# Altium project SuperGameBro_RevA0.PrjPcb
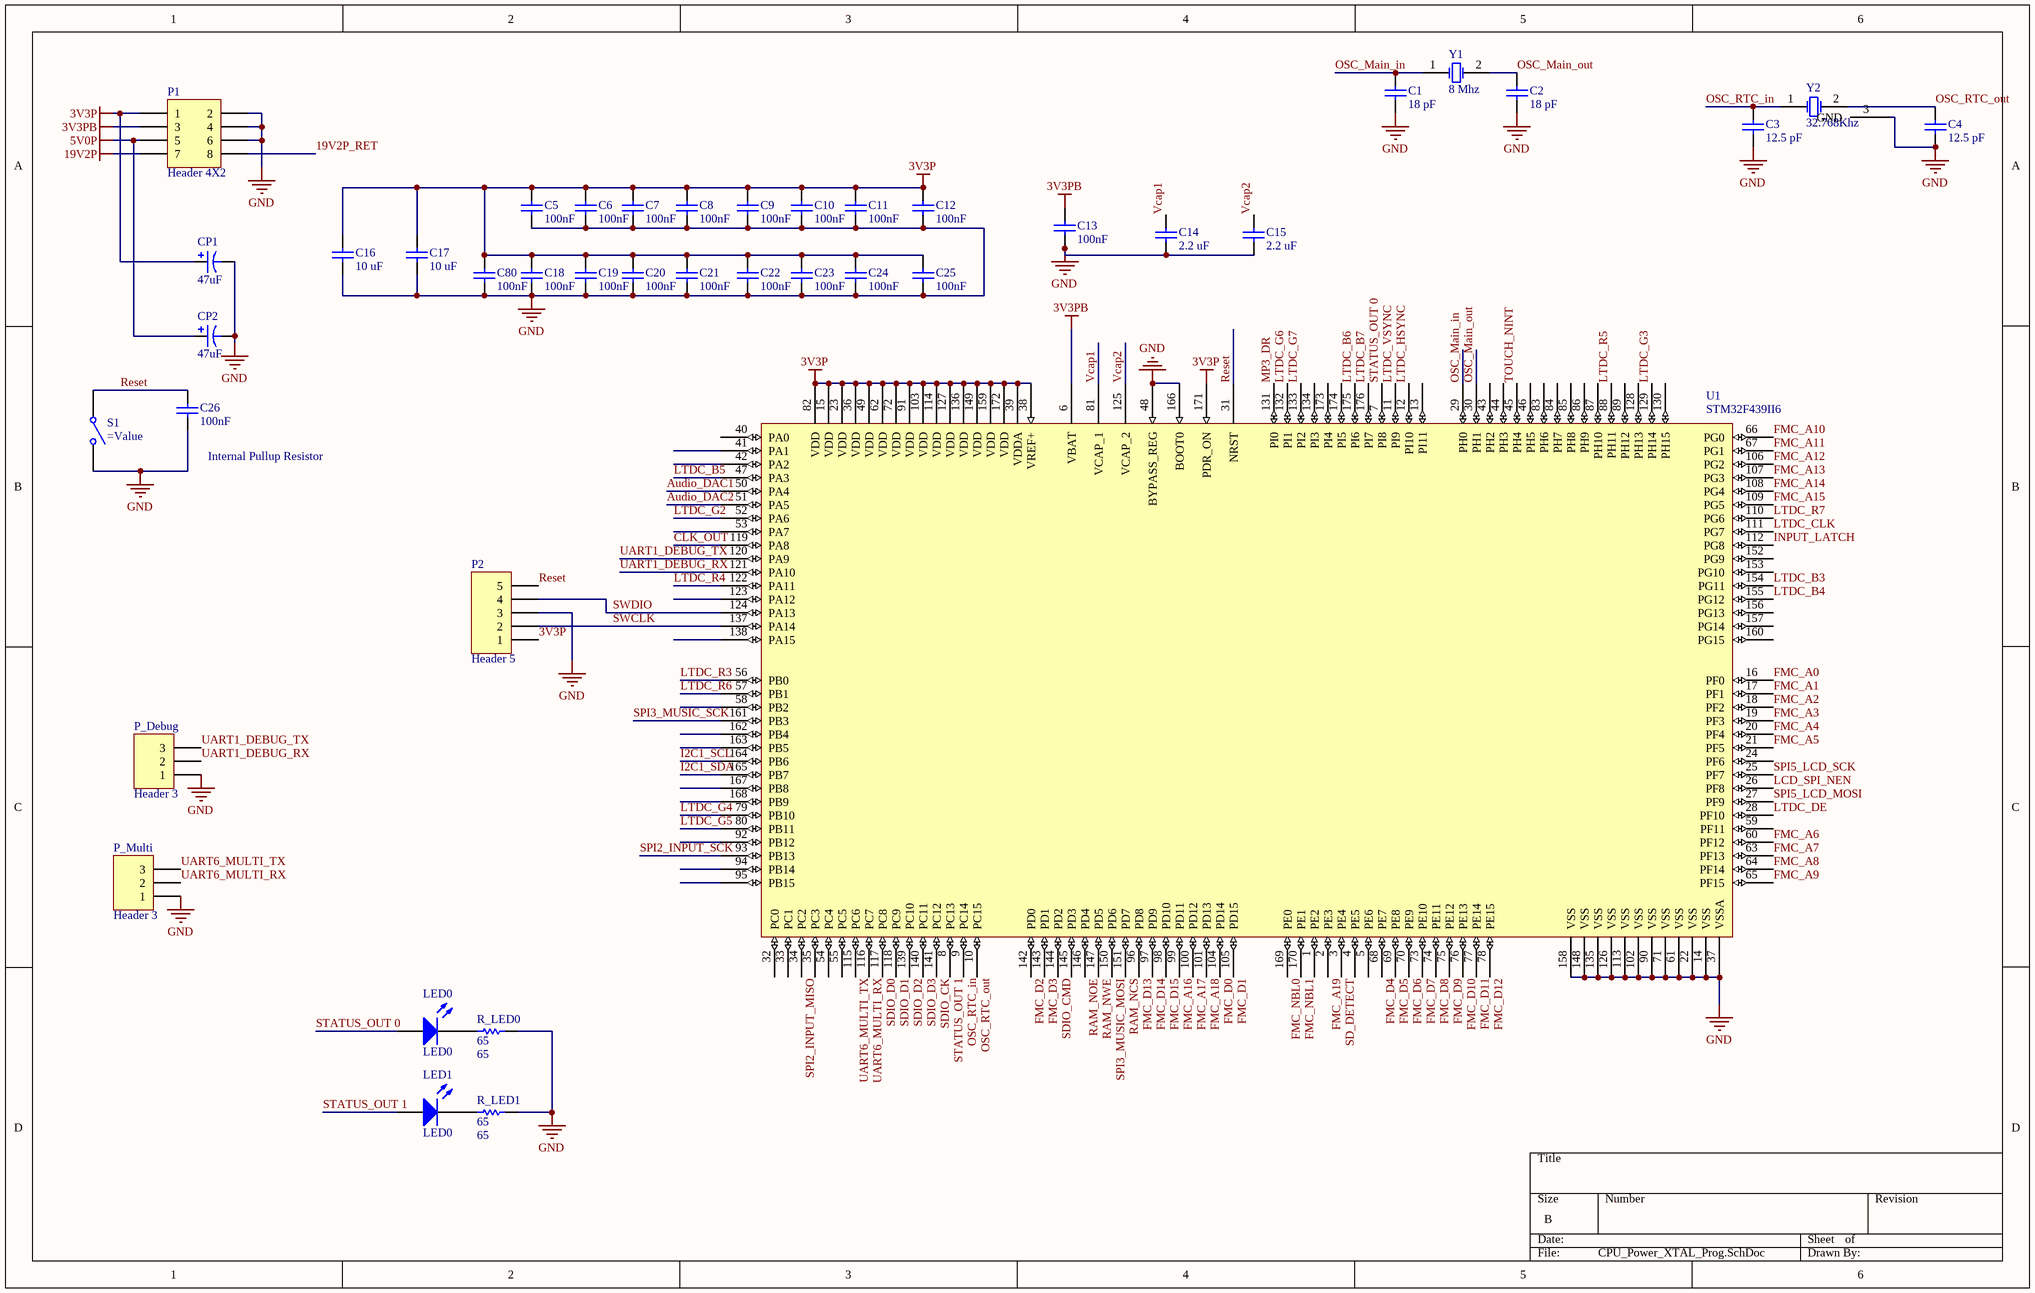
[diagram p0: CPU_Power_XTAL_Prog.SchDoc]
5 sheets, 150 parts. Net scope: global (net labels, ports and power ports of the same name join across sheets).
Board files: SuperGameBro_RevA0.PcbDoc, SuperGameBro_RevA1.PcbDoc
Sheets:
  CPU_Power_XTAL_Prog.SchDoc
  sdcard_ram.SchDoc
  Buttons.SchDoc
  LCD_touch_conn.SchDoc
  Audio.SchDoc

## Sheet CPU_Power_XTAL_Prog.SchDoc
size B

### Parts
C1  18 pF  [C0805]
C2  18 pF  [C0805]
C3  12.5 pF  [C0805]
C4  12.5 pF  [C0805]
C5  100nF  [C0805]
C6  100nF  [C0805]
C7  100nF  [C0805]
C8  100nF  [C0805]
C9  100nF  [C0805]
C10  100nF  [C0805]
C11  100nF  [C0805]
C12  100nF  [C0805]
C13  100nF  [C0805]
C14  2.2 uF  [C0805]
C15  2.2 uF  [C0805]
C16  10 uF  [C0805]
C17  10 uF  [C0805]
C18  100nF  [C0805]
C19  100nF  [C0805]
C20  100nF  [C0805]
C21  100nF  [C0805]
C22  100nF  [C0805]
C23  100nF  [C0805]
C24  100nF  [C0805]
C25  100nF  [C0805]
C26  100nF  [C0805]
C80  100nF  [C0805]
CP1  47uF  [KemetC3]
CP2  47uF  [KemetC3]
LED0  LED0  [LED-LTST]
LED1  LED0  [LED-LTST]
P1  Header 4X2  [Molex MiniFit Jr8]
P2  Header 5  [HDR1X5]
P_Debug  Header 3  [HDR1X3]
P_Multi  Header 3  [HDR1X3]
R_LED0  65  [6-0805_M]
R_LED1  65  [6-0805_M]
S1  (no value)  [Reset_Button]
U1  STM32F439II6  [LQFP76]
Y1  8 Mhz  [HC-49U]
Y2  32.768Khz  [C-2Type Crystal]

### Nets
3V3P: C5.2 C6.2 C7.2 C8.2 C9.2 C10.2 C11.2 C12.2 C16.2 C17.2 C18.2 C19.2 C20.2 C21.2 C22.2 C23.2 C24.2 C25.2 C80.2 CP1.2 P1.1 P2.1 U1.15(VDD) U1.23(VDD) U1.36(VDD) U1.38(VREF+) U1.39(VDDA) U1.49(VDD) U1.62(VDD) U1.72(VDD) U1.82(VDD) U1.91(VDD) U1.103(VDD) U1.114(VDD) U1.127(VDD) U1.136(VDD) U1.149(VDD) U1.159(VDD) U1.171(PDR_ON) U1.172(VDD)
3V3PB: C13.1 P1.3 U1.6(VBAT)
5V0P: CP2.2 P1.5
19V2P: P1.7
GND: C1.1 C2.1 C3.1 C4.1 C5.1 C6.1 C7.1 C8.1 C9.1 C10.1 C11.1 C12.1 C13.2 C14.2 C15.2 C16.1 C17.1 C18.1 C19.1 C20.1 C21.1 C22.1 C23.1 C24.1 C25.1 C26.1 C80.1 CP1.1 CP2.1 P1.2 P1.4 P1.6 P2.3 P_Debug.1 P_Multi.1 R_LED0.2 R_LED1.2 S1.1(NO) U1.14(VSS) U1.22(VSS) U1.37(VSSA) U1.48(BYPASS_REG) U1.61(VSS) U1.71(VSS) U1.90(VSS) U1.102(VSS) U1.113(VSS) U1.126(VSS) U1.135(VSS) U1.148(VSS) U1.158(VSS) U1.166(BOOT0) Y2.3(GND)
19V2P_RET: P1.8
Audio_DAC1: U1.50(PA4)
Audio_DAC2: U1.51(PA5)
CLK_OUT: U1.119(PA8)
FMC_A0: U1.16(PF0)
FMC_A1: U1.17(PF1)
FMC_A2: U1.18(PF2)
FMC_A3: U1.19(PF3)
FMC_A4: U1.20(PF4)
FMC_A5: U1.21(PF5)
FMC_A6: U1.60(PF12)
FMC_A7: U1.63(PF13)
FMC_A8: U1.64(PF14)
FMC_A9: U1.65(PF15)
FMC_A10: U1.66(PG0)
FMC_A11: U1.67(PG1)
FMC_A12: U1.106(PG2)
FMC_A13: U1.107(PG3)
FMC_A14: U1.108(PG4)
FMC_A15: U1.109(PG5)
FMC_A16: U1.99(PD11)
FMC_A17: U1.100(PD12)
FMC_A18: U1.101(PD13)
FMC_A19: U1.2(PE3)
FMC_D0: U1.104(PD14)
FMC_D1: U1.105(PD15)
FMC_D2: U1.142(PD0)
FMC_D3: U1.143(PD1)
FMC_D4: U1.68(PE7)
FMC_D5: U1.69(PE8)
FMC_D6: U1.70(PE9)
FMC_D7: U1.73(PE10)
FMC_D8: U1.74(PE11)
FMC_D9: U1.75(PE12)
FMC_D10: U1.76(PE13)
FMC_D11: U1.77(PE14)
FMC_D12: U1.78(PE15)
FMC_D13: U1.96(PD8)
FMC_D14: U1.97(PD9)
FMC_D15: U1.98(PD10)
FMC_NBL0: U1.169(PE0)
FMC_NBL1: U1.170(PE1)
I2C1_SCL: U1.164(PB6)
I2C1_SDA: U1.165(PB7)
INPUT_LATCH: U1.112(PG8)
LCD_SPI_NEN: U1.26(PF8)
LTDC_B3: U1.154(PG11)
LTDC_B4: U1.155(PG12)
LTDC_B5: U1.47(PA3)
LTDC_B6: U1.175(PI6)
LTDC_B7: U1.176(PI7)
LTDC_CLK: U1.111(PG7)
LTDC_DE: U1.28(PF10)
LTDC_G2: U1.52(PA6)
LTDC_G3: U1.129(PH14)
LTDC_G4: U1.79(PB10)
LTDC_G5: U1.80(PB11)
LTDC_G6: U1.132(PI1)
LTDC_G7: U1.133(PI2)
LTDC_HSYNC: U1.12(PI10)
LTDC_R3: U1.56(PB0)
LTDC_R4: U1.122(PA11)
LTDC_R5: U1.88(PH11)
LTDC_R6: U1.57(PB1)
LTDC_R7: U1.110(PG6)
LTDC_VSYNC: U1.11(PI9)
MP3_DR: U1.131(PI0)
OSC_Main_in: C1.2 U1.29(PH0) Y1.1(OSC1)
OSC_Main_out: C2.2 U1.30(PH1) Y1.2(OSC2)
OSC_RTC_in: C3.2 U1.9(PC14) Y2.1(OSC1)
OSC_RTC_out: C4.2 U1.10(PC15) Y2.2(OSC2)
RAM_NCS: U1.151(PD7)
RAM_NOE: U1.146(PD4)
RAM_NWE: U1.147(PD5)
Reset: C26.2 P2.5 S1.0(COMMON) U1.31(NRST)
SD_DETECT: U1.3(PE4)
SDIO_CK: U1.141(PC12)
SDIO_CMD: U1.144(PD2)
SDIO_D0: U1.117(PC8)
SDIO_D1: U1.118(PC9)
SDIO_D2: U1.139(PC10)
SDIO_D3: U1.140(PC11)
SPI2_INPUT_MISO: U1.34(PC2)
SPI2_INPUT_SCK: U1.93(PB13)
SPI3_MUSIC_MOSI: U1.150(PD6)
SPI3_MUSIC_SCK: U1.161(PB3)
SPI5_LCD_MOSI: U1.27(PF9)
SPI5_LCD_SCK: U1.25(PF7)
STATUS_OUT 0: LED0.A U1.7(PI8)
STATUS_OUT 1: LED1.A U1.8(PC13)
SWCLK: P2.2 U1.137(PA14)
SWDIO: P2.4 U1.124(PA13)
TOUCH_NINT: U1.45(PH4)
UART1_DEBUG_RX: P_Debug.2 U1.121(PA10)
UART1_DEBUG_TX: P_Debug.3 U1.120(PA9)
UART6_MULTI_RX: P_Multi.2 U1.116(PC7)
UART6_MULTI_TX: P_Multi.3 U1.115(PC6)
Vcap1: C14.1 U1.81(VCAP_1)
Vcap2: C15.1 U1.125(VCAP_2)
NetLED0_K: LED0.K R_LED0.1
NetLED1_K: LED1.K R_LED1.1

Not connected (* = marked no-connect by the designer): U1 1(PE2) 4(PE5) 5(PE6) 13(PI11) 24(PF6) 32(PC0) 33(PC1) 35(PC3) 40(PA0) 41(PA1) 42(PA2) 43(PH2) 44(PH3) 46(PH5) 53(PA7) 54(PC4) 55(PC5) 58(PB2) 59(PF11) 83(PH6) 84(PH7) 85(PH8) 86(PH9) 87(PH10) 89(PH12) 92(PB12) 94(PB14) 95(PB15) 123(PA12) 128(PH13) 130(PH15) 134(PI3) 138(PA15) 145(PD3) 152(PG9) 153(PG10) 156(PG13) 157(PG14) 160(PG15) 162(PB4) 163(PB5) 167(PB8) 168(PB9) 173(PI4) 174(PI5)

### Notes on the sheet
- (near C26) Internal Pullup Resistor

### Library data of the parts
C1-C26 C80 = Cap: Capacitor; Published: 8-Jun-2000; LatestRevisionDate: 17-Jul-2002; LatestRevisionNote: Re-released for DXP Platform.; PackageReference: RAD-0.3; Publisher: Altium Limited; PackageDescription: Radial Cap, Thru-Hole; 2 Leads; 0.3 in Pin Spacing
  C1 C2: Value: 18 pF
  C3 C4: Value: 12.5 pF
  C5-C13 C18-C26 C80: Value: 100nF
  C14 C15: Value: 2.2 uF
  C16 C17: Value: 10 uF
CP1 CP2 = Cap Pol1: Polarized Capacitor (Radial); Published: 8-Jun-2000; LatestRevisionDate: 17-Jul-2002; LatestRevisionNote: Re-released for DXP Platform.; PackageReference: RB7.6-15; Publisher: Altium Limited; PackageDescription: Polarized Capacitor (Radial); 2 Leads; Value: 47uF
LED0 LED1 = LED0: Typical INFRARED GaAs LED; Published: 8-Jun-2000; LatestRevisionDate: 08-Jul-2005; LatestRevisionNote: Mech Layer 1 removed.; PackageReference: LED-0; Publisher: Altium Limited; PackageDescription: LED; 2 Leads
P1 = Header 4X2: Header, 4-Pin, Dual row; LatestRevisionDate: 17-Jul-2002; LatestRevisionNote: Re-released for DXP Platform.; Publisher: Altium Limited
P2 = Header 5: Header, 5-Pin; LatestRevisionDate: 17-Jul-2002; LatestRevisionNote: Re-released for DXP Platform.; Publisher: Altium Limited
P_Debug P_Multi = Header 3: Header, 3-Pin; LatestRevisionDate: 17-Jul-2002; LatestRevisionNote: Re-released for DXP Platform.; Publisher: Altium Limited
R_LED0 R_LED1 = Res1: Resistor; Published: 8-Jun-2000; LatestRevisionDate: 17-Jul-2002; LatestRevisionNote: Re-released for DXP Platform.; PackageReference: AXIAL-0.3; Publisher: Altium Limited; PackageDescription: Axial Device, Thru-Hole; 2 Leads; 0.3 in Pin Spacing; Value: 65
S1 = SW-SPST: Single-Pole, Single-Throw Switch; Published: 24-Mar-1999; LatestRevisionDate: 17-Jul-2002; LatestRevisionNote: Re-released for DXP Platform.; PackageReference: SPST-2; Publisher: Altium Limited; PackageDescription: Switch; 2 Leads
U1 = STM32F439IIT6: Arm Cortex M4 Processor
Y1 Y2 = XTAL: Crystal Oscillator; Published: 8-Jun-2000; LatestRevisionDate: 17-Jul-2002; LatestRevisionNote: Re-released for DXP Platform.; PackageReference: R38; Publisher: Altium Limited; PackageDescription: Crystal, Thru-Hole; 2 Leads; Body 3.1 x 8.2 mm (Dia.xH)

## Sheet sdcard_ram.SchDoc
size Letter
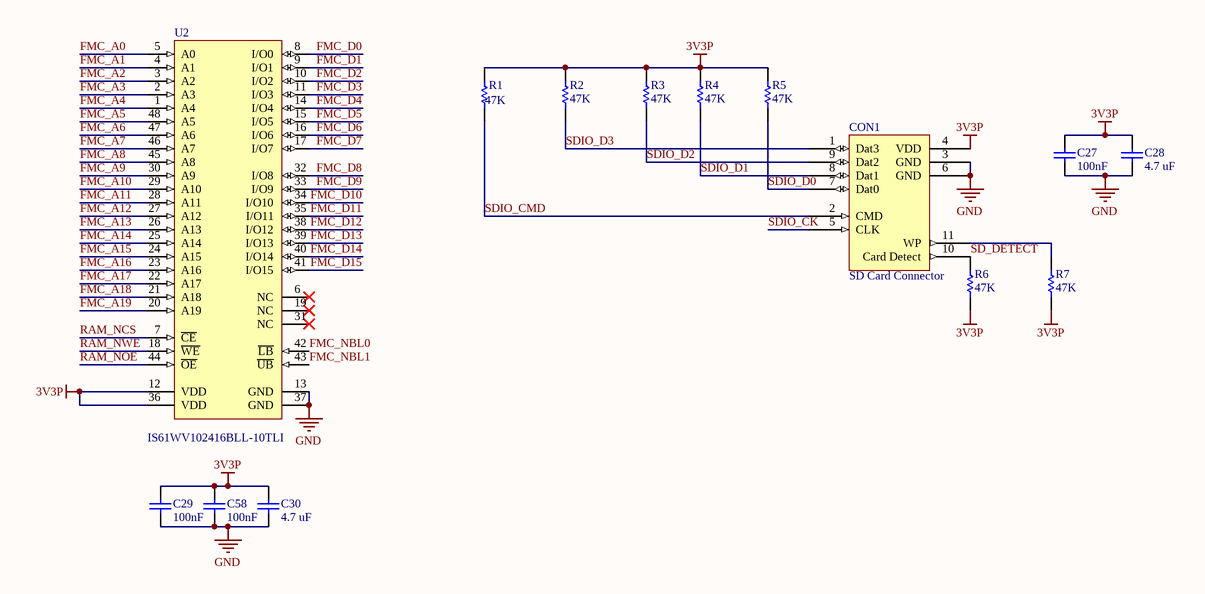
[diagram p1: sdcard_ram.SchDoc]

### Parts
C27  100nF  [C0805]
C28  4.7 uF  [C0805]
C29  100nF  [C0805]
C30  4.7 uF  [C0805]
C58  100nF  [C0805]
CON1  SD Card Connector  [SD_card_fp]
R1  47K  [6-0805_M]
R2  47K  [6-0805_M]
R3  47K  [6-0805_M]
R4  47K  [6-0805_M]
R5  47K  [6-0805_M]
R6  47K  [6-0805_M]
R7  47K  [6-0805_M]
U2  IS61WV102416BLL-10TLI  [ISSI-TSOP-1-48-12000X20000DE_N]

### Nets
3V3P: C27.2 C28.2 C29.2 C30.2 C58.2 CON1.4(VDD) R1.2 R2.2 R3.2 R4.2 R5.2 R6.1 R7.1 U2.12(VDD) U2.36(VDD)
GND: C27.1 C28.1 C29.1 C30.1 C58.1 CON1.3(GND) CON1.6(GND) U2.13(GND) U2.37(GND)
FMC_A0: U2.5(A0)
FMC_A1: U2.4(A1)
FMC_A2: U2.3(A2)
FMC_A3: U2.2(A3)
FMC_A4: U2.1(A4)
FMC_A5: U2.48(A5)
FMC_A6: U2.47(A6)
FMC_A7: U2.46(A7)
FMC_A8: U2.45(A8)
FMC_A9: U2.30(A9)
FMC_A10: U2.29(A10)
FMC_A11: U2.28(A11)
FMC_A12: U2.27(A12)
FMC_A13: U2.26(A13)
FMC_A14: U2.25(A14)
FMC_A15: U2.24(A15)
FMC_A16: U2.23(A16)
FMC_A17: U2.22(A17)
FMC_A18: U2.21(A18)
FMC_A19: U2.20(A19)
FMC_D0: U2.8(I/O0)
FMC_D1: U2.9(I/O1)
FMC_D2: U2.10(I/O2)
FMC_D3: U2.11(I/O3)
FMC_D4: U2.14(I/O4)
FMC_D5: U2.15(I/O5)
FMC_D6: U2.16(I/O6)
FMC_D7: U2.17(I/O7)
FMC_D8: U2.32(I/O8)
FMC_D9: U2.33(I/O9)
FMC_D10: U2.34(I/O10)
FMC_D11: U2.35(I/O11)
FMC_D12: U2.38(I/O12)
FMC_D13: U2.39(I/O13)
FMC_D14: U2.40(I/O14)
FMC_D15: U2.41(I/O15)
FMC_NBL0: U2.42(~{LB})
FMC_NBL1: U2.43(~{UB})
RAM_NCS: U2.7(~{CE})
RAM_NOE: U2.44(~{OE})
RAM_NWE: U2.18(~{WE})
SD_DETECT: CON1.10(Card_Detect) R6.2
SDIO_CK: CON1.5(CLK)
SDIO_CMD: CON1.2(CMD) R1.1
SDIO_D0: CON1.7(Dat0) R5.1
SDIO_D1: CON1.8(Dat1) R4.1
SDIO_D2: CON1.9(Dat2) R3.1
SDIO_D3: CON1.1(Dat3) R2.1
NetCON1_11: CON1.11(WP) R7.2

Not connected (* = marked no-connect by the designer): U2 6(NC)* 19(NC)* 31(NC)*

### Library data of the parts
C27-C30 C58 = Cap: Capacitor; Published: 8-Jun-2000; LatestRevisionDate: 17-Jul-2002; LatestRevisionNote: Re-released for DXP Platform.; PackageReference: RAD-0.3; Publisher: Altium Limited; PackageDescription: Radial Cap, Thru-Hole; 2 Leads; 0.3 in Pin Spacing
  C27 C29 C58: Value: 100nF
  C28 C30: Value: 4.7 uF
CON1 = SD Card Connector: 3M™ Card Connector SD™
R1-R7 = Res1: Resistor; Published: 8-Jun-2000; LatestRevisionDate: 17-Jul-2002; LatestRevisionNote: Re-released for DXP Platform.; PackageReference: AXIAL-0.3; Publisher: Altium Limited; PackageDescription: Axial Device, Thru-Hole; 2 Leads; 0.3 in Pin Spacing; Value: 47K
U2 = IS61WV102416BLL-10TLI: 16 M High Speed Asynchronous CMOS SRAM with 3.3 V Supply, 1 M x 16, -40 to 85 degC, 48-Pin SOP (TSOP-1-48), Pb-Free; Manufacturer: Integrated Silicon Solution Inc (ISSI); Density: 16M; Organization: 1M x 16; Packing: Tray / Tube; Speed (ns): 10; DatasheetVersion: Rev. F; PackageVersion: Rev. B, 07/2006; PackageReference: TSOP-1-48; PackageDescription: 48-Pin 12 x 20 mm TSOP-1, Pitch 0.5 mm; Supplier 1: Digi-Key; Supplier Part Number 1: 706-1055-ND; Supplier 2: Farnell; Supplier Part Number 2: 2253839; Supplier 3: Newark; Supplier Part Number 3: 53W9303; Supplier 4: Newark; Supplier Part Number 4: 43M5379; Supplier 5: Mouser; Supplier Part Number 5: 870-61WV102416B10TLI; RoHS: Pb-Free; Mounting Technology: Surface Mount; PartNumber: IS61WV102416BLL-10TLI; ComponentLink1Description: Manufacturer URL; ComponentLink1URL: http://www.issi.com/US/index.shtml; ComponentLink2Description: Datasheet; ComponentLink2URL: http://www.issi.com/WW/pdf/61WV102416ALL.pdf; ComponentLink3Description: Package Specification; ComponentLink3URL: http://www.issi.com/WW/pdf/61WV102416ALL.pdf

## Sheet Buttons.SchDoc
size Letter
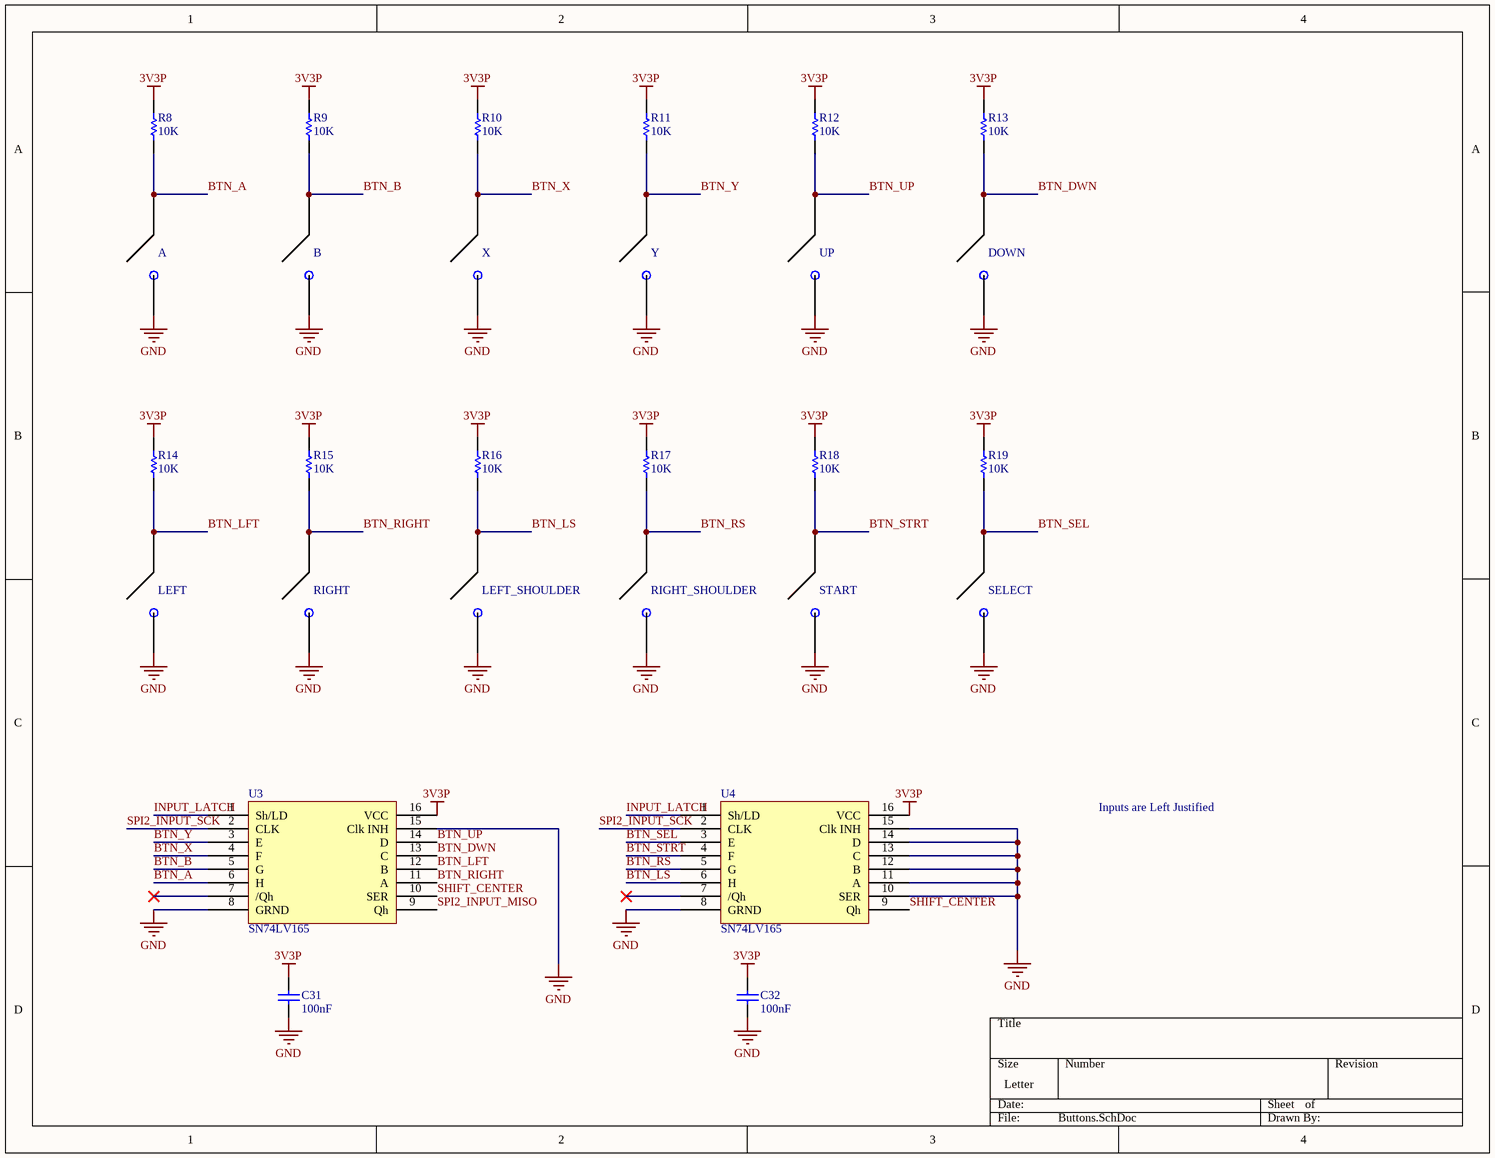
[diagram p2: Buttons.SchDoc]

### Parts
A  12mmBTN  [SMT12mmbutton]  (value not drawn)
B  12mmBTN  [SMT12mmbutton]  (value not drawn)
C31  100nF  [C0805]
C32  100nF  [C0805]
DOWN  12mmBTN  [SMT12mmbutton]  (value not drawn)
LEFT  12mmBTN  [SMT12mmbutton]  (value not drawn)
LEFT_SHOULDER  12mmBTN  [HDR1X2]  (value not drawn)
R8  10K  [6-0805_M]
R9  10K  [6-0805_M]
R10  10K  [6-0805_M]
R11  10K  [6-0805_M]
R12  10K  [6-0805_M]
R13  10K  [6-0805_M]
R14  10K  [6-0805_M]
R15  10K  [6-0805_M]
R16  10K  [6-0805_M]
R17  10K  [6-0805_M]
R18  10K  [6-0805_M]
R19  10K  [6-0805_M]
RIGHT  12mmBTN  [SMT12mmbutton]  (value not drawn)
RIGHT_SHOULDER  12mmBTN  [HDR1X2]  (value not drawn)
SELECT  12mmBTN  [SMT12mmbutton]  (value not drawn)
START  12mmBTN  [SMT12mmbutton]  (value not drawn)
U3  SN74LV165  [SOP16_Hand]
U4  SN74LV165  [SOP16_Hand]
UP  12mmBTN  [SMT12mmbutton]  (value not drawn)
X  12mmBTN  [SMT12mmbutton]  (value not drawn)
Y  12mmBTN  [SMT12mmbutton]  (value not drawn)

### Nets
3V3P: C31.2 C32.2 R8.1 R9.1 R10.1 R11.1 R12.1 R13.1 R14.1 R15.1 R16.1 R17.1 R18.1 R19.1 U3.16(VCC) U4.16(VCC)
GND: A.0 B.0 C31.1 C32.1 DOWN.0 LEFT.0 LEFT_SHOULDER.1 RIGHT.0 RIGHT_SHOULDER.1 SELECT.0 START.0 U3.8(GRND) U3.15(Clk_INH) U4.8(GRND) U4.10(SER) U4.11(A) U4.12(B) U4.13(C) U4.14(D) U4.15(Clk_INH) UP.0 X.0 Y.0
BTN_A: A.1 R8.2 U3.6(H)
BTN_B: B.1 R9.2 U3.5(G)
BTN_DWN: DOWN.1 R13.2 U3.13(C)
BTN_LFT: LEFT.1 R14.2 U3.12(B)
BTN_LS: LEFT_SHOULDER.2 R16.2 U4.6(H)
BTN_RIGHT: R15.2 RIGHT.1 U3.11(A)
BTN_RS: R17.2 RIGHT_SHOULDER.2 U4.5(G)
BTN_SEL: R19.2 SELECT.1 U4.3(E)
BTN_STRT: R18.2 START.1 U4.4(F)
BTN_UP: R12.2 U3.14(D) UP.1
BTN_X: R10.2 U3.4(F) X.1
BTN_Y: R11.2 U3.3(E) Y.1
INPUT_LATCH: U3.1(Sh/LD) U4.1(Sh/LD)
SHIFT_CENTER: U3.10(SER) U4.9(Qh)
SPI2_INPUT_MISO: U3.9(Qh)
SPI2_INPUT_SCK: U3.2(CLK) U4.2(CLK)

Not connected (* = marked no-connect by the designer): U3 7(/Qh)*; U4 7(/Qh)*

### Notes on the sheet
- Inputs are Left Justified

### Library data of the parts
C31 C32 = Cap: Capacitor; Published: 8-Jun-2000; LatestRevisionDate: 17-Jul-2002; LatestRevisionNote: Re-released for DXP Platform.; PackageReference: RAD-0.3; Publisher: Altium Limited; PackageDescription: Radial Cap, Thru-Hole; 2 Leads; 0.3 in Pin Spacing; Value: 100nF
R8-R19 = Res1: Resistor; Published: 8-Jun-2000; LatestRevisionDate: 17-Jul-2002; LatestRevisionNote: Re-released for DXP Platform.; PackageReference: AXIAL-0.3; Publisher: Altium Limited; PackageDescription: Axial Device, Thru-Hole; 2 Leads; 0.3 in Pin Spacing; Value: 10K

## Sheet LCD_touch_conn.SchDoc
size Letter
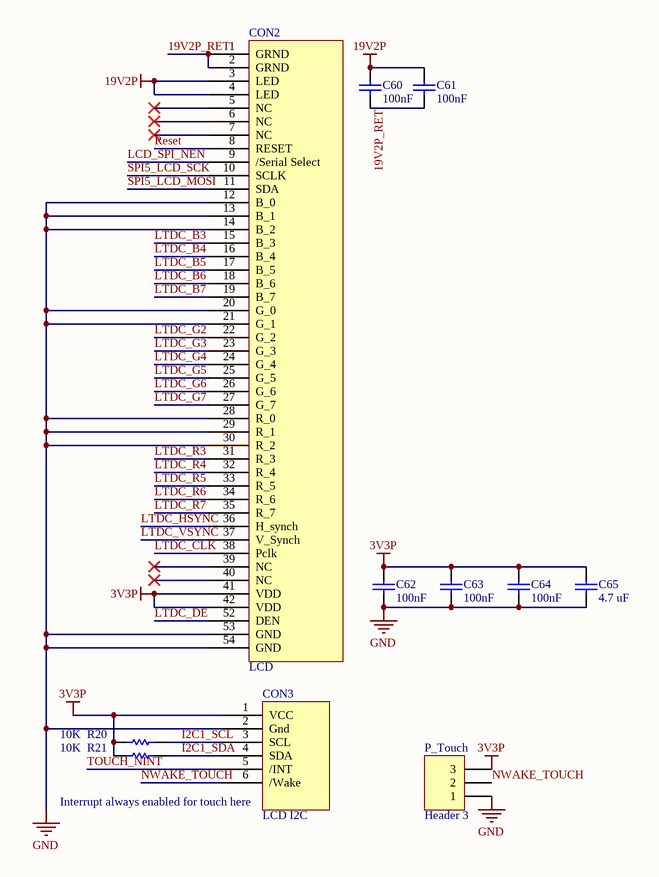
[diagram p3: LCD_touch_conn.SchDoc]

### Parts
C60  100nF  [C0805]
C61  100nF  [C0805]
C62  100nF  [C0805]
C63  100nF  [C0805]
C64  100nF  [C0805]
C65  4.7 uF  [C0805]
CON2  LCD  [Molex54 - duplicate2]
CON3  LCD I2C  [Molex6]
P_Touch  Header 3  [HDR1X3]
R20  10K  [6-0805_M]
R21  10K  [6-0805_M]

### Nets
3V3P: C62.2 C63.2 C64.2 C65.2 CON2.41(VDD) CON2.42(VDD) CON3.1(VCC) P_Touch.3 R20.1 R21.1
19V2P: C60.2 C61.2 CON2.3(LED) CON2.4(LED)
GND: C62.1 C63.1 C64.1 C65.1 CON2.12(B_0) CON2.13(B_1) CON2.14(B_2) CON2.20(G_0) CON2.21(G_1) CON2.28(R_0) CON2.29(R_1) CON2.30(R_2) CON2.53(GND) CON2.54(GND) CON3.2(Gnd) P_Touch.1
19V2P_RET: C60.1 C61.1 CON2.1(GRND) CON2.2(GRND)
I2C1_SCL: CON3.3(SCL) R20.2
I2C1_SDA: CON3.4(SDA) R21.2
LCD_SPI_NEN: CON2.9(/Serial_Select)
LTDC_B3: CON2.15(B_3)
LTDC_B4: CON2.16(B_4)
LTDC_B5: CON2.17(B_5)
LTDC_B6: CON2.18(B_6)
LTDC_B7: CON2.19(B_7)
LTDC_CLK: CON2.38(Pclk)
LTDC_DE: CON2.52(DEN)
LTDC_G2: CON2.22(G_2)
LTDC_G3: CON2.23(G_3)
LTDC_G4: CON2.24(G_4)
LTDC_G5: CON2.25(G_5)
LTDC_G6: CON2.26(G_6)
LTDC_G7: CON2.27(G_7)
LTDC_HSYNC: CON2.36(H_synch)
LTDC_R3: CON2.31(R_3)
LTDC_R4: CON2.32(R_4)
LTDC_R5: CON2.33(R_5)
LTDC_R6: CON2.34(R_6)
LTDC_R7: CON2.35(R_7)
LTDC_VSYNC: CON2.37(V_Synch)
NWAKE_TOUCH: CON3.6(/Wake) P_Touch.2
Reset: CON2.8(RESET)
SPI5_LCD_MOSI: CON2.11(SDA)
SPI5_LCD_SCK: CON2.10(SCLK)
TOUCH_NINT: CON3.5(/INT)

Not connected (* = marked no-connect by the designer): CON2 5(NC)* 6(NC)* 7(NC)* 39(NC)* 40(NC)*

### Notes on the sheet
- (near CON3) Interrupt always enabled for touch here

### Library data of the parts
C60-C65 = Cap: Capacitor; Published: 8-Jun-2000; LatestRevisionDate: 17-Jul-2002; LatestRevisionNote: Re-released for DXP Platform.; PackageReference: RAD-0.3; Publisher: Altium Limited; PackageDescription: Radial Cap, Thru-Hole; 2 Leads; 0.3 in Pin Spacing
  C60-C64: Value: 100nF
  C65: Value: 4.7 uF
CON2 = LCD: pin to pad: 1>A1 2>A2 3>A3 4>A4 5>A5 6>A6 7>A7 8>A8 9>A9 10>A10 11>A11 12>A12 13>A13 14>A14 15>A15 16>A16 17>A17 18>A18 19>A19 20>A20 21>A21 22>A22 23>A23 24>A24 25>A25 26>A26 27>A27 28>A28 29>A29 30>A30 31>A31 32>A32 33>A33 34>A34 35>A35 36>A36 37>A37 38>A38 39>A39 40>A40 41>A41 42>A42 52>A52 53>A53 54>A54
P_Touch = Header 3: Header, 3-Pin; LatestRevisionDate: 17-Jul-2002; LatestRevisionNote: Re-released for DXP Platform.; Publisher: Altium Limited
R20 R21 = Res1: Resistor; Published: 8-Jun-2000; LatestRevisionDate: 17-Jul-2002; LatestRevisionNote: Re-released for DXP Platform.; PackageReference: AXIAL-0.3; Publisher: Altium Limited; PackageDescription: Axial Device, Thru-Hole; 2 Leads; 0.3 in Pin Spacing; Value: 10K

## Sheet Audio.SchDoc
size Letter
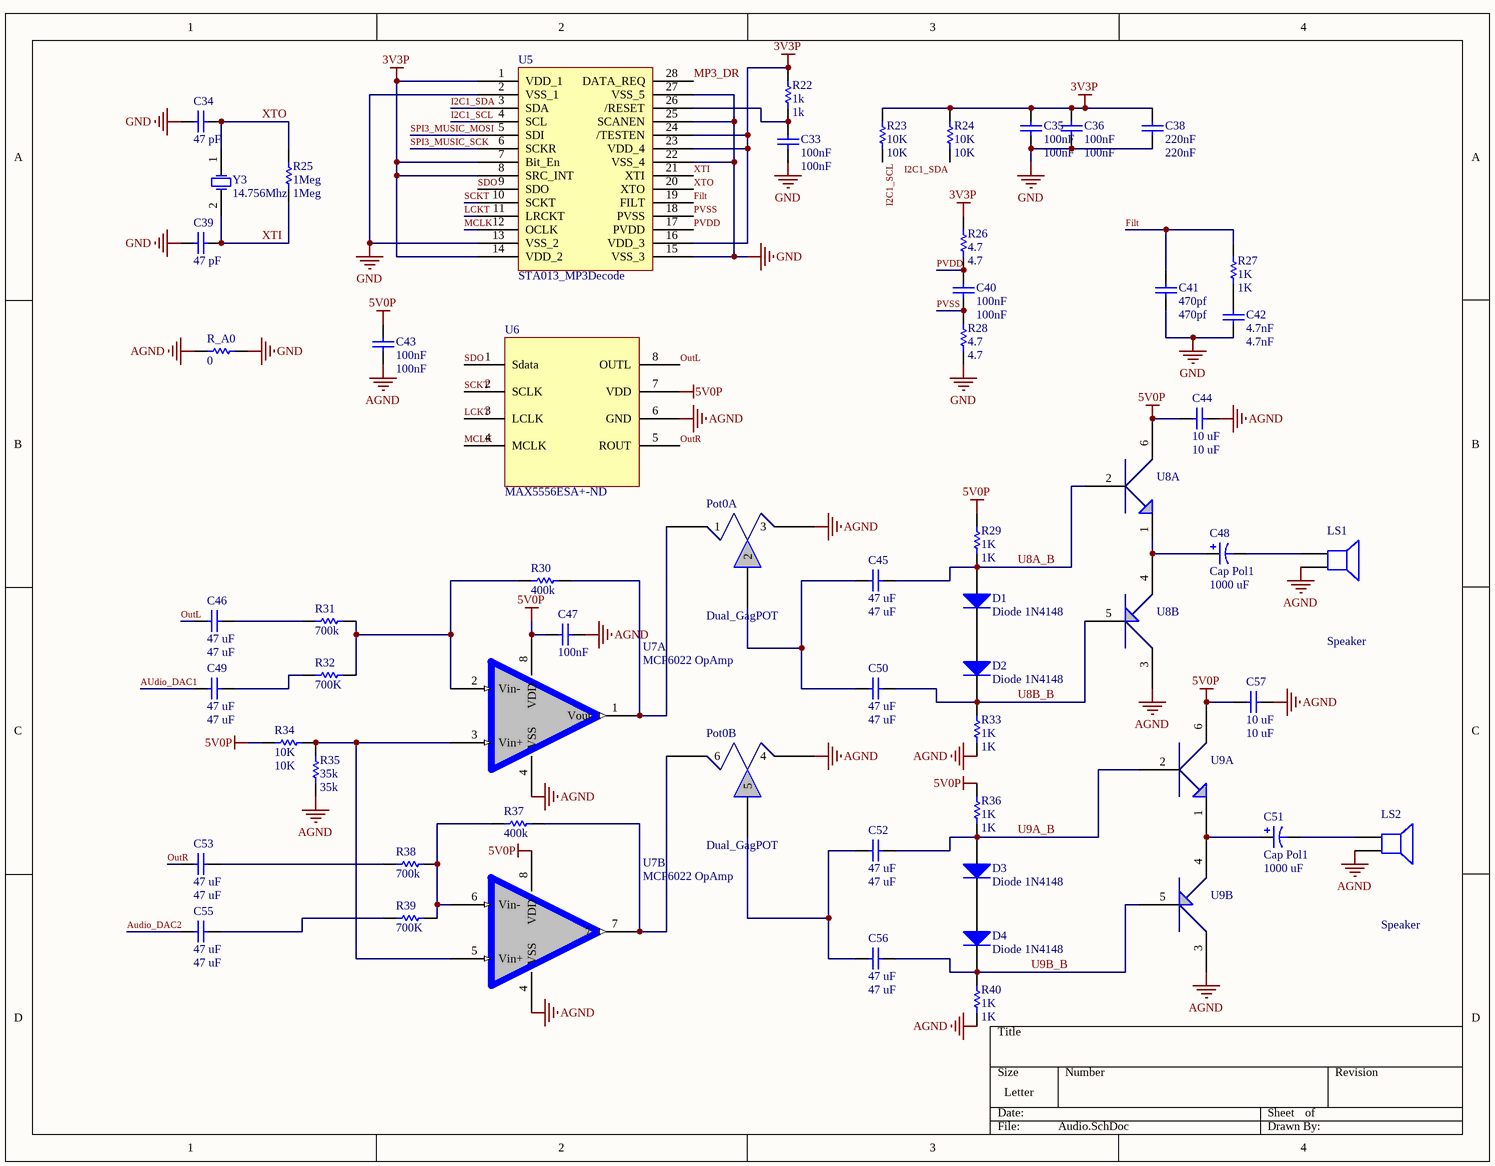
[diagram p4: Audio.SchDoc]

### Parts
C33  100nF  [C0805]
C34  47 pF  [C0805]
C35  100nF  [C0805]
C36  100nF  [C0805]
C38  220nF  [C0805]
C39  47 pF  [C0805]
C40  100nF  [C0805]
C41  470pf  [C0805]
C42  4.7nF  [C0805]
C43  100nF  [C0805]
C44  10 uF  [C0805]
C45  47 uF  [C0805]
C46  47 uF  [C0805]
C47  100nF  [C0805]
C48  Cap Pol1  value 1000 uF  [C2917]
C49  47 uF  [C0805]
C50  47 uF  [C0805]
C51  Cap Pol1  value 1000 uF  [C2917]
C52  47 uF  [C0805]
C53  47 uF  [C0805]
C55  47 uF  [C0805]
C56  47 uF  [C0805]
C57  10 uF  [C0805]
D1  Diode 1N4148  [Diode]
D2  Diode 1N4148  [Diode]
D3  Diode 1N4148  [Diode]
D4  Diode 1N4148  [Diode]
LS1  Speaker  [PIN2]
LS2  Speaker  [PIN2]
Pot0  Dual_GagPOT  [DGPOT]  (parts A,B of 2)
R22  1k  [6-0805_M]
R23  10K  [6-0805_M]
R24  10K  [6-0805_M]
R25  1Meg  [6-0805_M]
R26  4.7  [6-0805_M]
R27  1K  [6-0805_M]
R28  4.7  [6-0805_M]
R29  1K  [6-0805_M]
R30  400k  [6-0805_M]
R31  700k  [6-0805_M]
R32  700K  [6-0805_M]
R33  1K  [6-0805_M]
R34  10K  [6-0805_M]
R35  35k  [6-0805_M]
R36  1K  [6-0805_M]
R37  400k  [6-0805_M]
R38  700k  [6-0805_M]
R39  700K  [6-0805_M]
R40  1K  [6-0805_M]
R_A0  0  [6-0805_M]
U5  STA013_MP3Decode  [SOP28]
U6  MAX5556ESA+-ND  [SOIC8_DAC]
U7  MCP6022 OpAmp  [SOP8_Opamp]  (parts A,B of 2)
U8  BJT  [BJT_SOT6]  (value not drawn)  (parts A,B of 2)
U9  BJT  [BJT_SOT6]  (value not drawn)  (parts A,B of 2)
Y3  14.756Mhz  [HC-49U]

### Nets
3V3P: C35.2 C36.2 C38.2 R22.2 R23.2 R24.2 R26.1 U5.1(VDD_1) U5.7(Bit_En) U5.8(SRC_INT) U5.14(VDD_2) U5.16(VDD_3) U5.23(VDD_4) U5.24(/TESTEN)
5V0P: C43.2 C44.2 C47.1 C57.2 R29.1 R34.1 R36.1 U6.7(VDD) U7.8(VDD) U8.6(Collector) U9.6(Collector)
AGND: C43.1 C44.1 C47.2 C57.1 LS1.2 LS2.2 Pot0.3 Pot0.4 R33.2 R35.1 R40.2 R_A0.1 U6.6(GND) U7.4(VSS) U8.3(Collector) U9.3(Collector)
GND: C33.2 C34.1 C35.1 C36.1 C38.1 C39.1 C41.1 C42.1 R28.2 R_A0.2 U5.2(VSS_1) U5.13(VSS_2) U5.15(VSS_3) U5.22(VSS_4) U5.25(SCANEN) U5.27(VSS_5)
Audio_DAC1: C49.1
Audio_DAC2: C55.1
Filt: C41.2 R27.1 U5.19(FILT)
I2C1_SCL: R23.1 U5.4(SCL)
I2C1_SDA: R24.1 U5.3(SDA)
LCKT: U5.11(LRCKT) U6.3(LCLK)
MCLK: U5.12(OCLK) U6.4(MCLK)
MP3_DR: U5.28(DATA_REQ)
OutL: C46.1 U6.8(OUTL)
OutR: C53.1 U6.5(ROUT)
PVDD: C40.2 R26.2 U5.17(PVDD)
PVSS: C40.1 R28.1 U5.18(PVSS)
SCKT: U5.10(SCKT) U6.2(SCLK)
SDO: U5.9(SDO) U6.1(Sdata)
SPI3_MUSIC_MOSI: U5.5(SDI)
SPI3_MUSIC_SCK: U5.6(SCKR)
U8A_B: C45.2 D1.A R29.2 U8.2(Base)
U8B_B: C50.2 D2.K R33.1 U8.5(Base)
U9A_B: C52.2 D3.A R36.2 U9.2(Base)
U9B_B: C56.2 D4.K R40.1 U9.5(Base)
XTI: C39.2 R25.1 U5.21(XTI) Y3.2(OSC2)
XTO: C34.2 R25.2 U5.20(XTO) Y3.1(OSC1)
NetC33_1: C33.1 R22.1 U5.26(/RESET)
NetC42_2: C42.2 R27.2
NetC45_1: C45.1 C50.1 Pot0.2
NetC46_2: C46.2 R31.1
NetC48_1: C48.1 U8.1(Emitter) U8.4(Emitter)
NetC48_2: C48.2 LS1.1
NetC49_2: C49.2 R32.1
NetC51_1: C51.1 U9.1(Emitter) U9.4(Emitter)
NetC51_2: C51.2 LS2.1
NetC52_1: C52.1 C56.1 Pot0.5
NetC53_2: C53.2 R38.1
NetC55_2: C55.2 R39.1
NetD1_K: D1.K D2.A
NetD3_K: D3.K D4.A
NetPot0_1: Pot0.1 R30.2 U7.1(Vout)
NetPot0_6: Pot0.6 R37.2 U7.7
NetR30_1: R30.1 R31.2 R32.2 U7.2(Vin-)
NetR34_2: R34.2 R35.2 U7.3(Vin+) U7.5(Vin+)
NetR37_1: R37.1 R38.2 R39.2 U7.6(Vin-)

### Library data of the parts
C33-C36 C38-C47 C49 C50 C52 C53 C55-C57 = Cap: Capacitor; Published: 8-Jun-2000; LatestRevisionDate: 17-Jul-2002; LatestRevisionNote: Re-released for DXP Platform.; PackageReference: RAD-0.3; Publisher: Altium Limited; PackageDescription: Radial Cap, Thru-Hole; 2 Leads; 0.3 in Pin Spacing
  C33 C35 C36 C40 C43 C47: Value: 100nF
  C34 C39: Value: 47 pF
  C38: Value: 220nF
  C41: Value: 470pf
  C42: Value: 4.7nF
  C44 C57: Value: 10 uF
  C45 C46 C49 C50 C52 C53 C55 C56: Value: 47 uF
C48 C51 = Cap Pol1: Polarized Capacitor (Radial); Published: 8-Jun-2000; LatestRevisionDate: 17-Jul-2002; LatestRevisionNote: Re-released for DXP Platform.; PackageReference: RB7.6-15; Publisher: Altium Limited; PackageDescription: Polarized Capacitor (Radial); 2 Leads
D1-D4 = Diode 1N4148: High Conductance Fast Diode; Published: 8-Jun-2000; LatestRevisionDate: 17-Jul-2002; LatestRevisionNote: Re-released for DXP Platform.; DatasheetVersion: 1997; PackageReference: DO-35; Publisher: Altium Limited; PackageDescription: Diode, Axial; Body 3.8 x 1.9 mm (LxDia. max), Lead Dia. 0.53 mm (max); Code_JEDEC: DO-204-AH; ComponentLink1Description: Manufacturer Link; ComponentLink1URL: http://www.fairchildsemi.com/; ComponentLink2Description: Datasheet; ComponentLink2URL: http://www.fairchildsemi.com/ds/1N%2F1N4148.pdf
LS1 LS2 = Speaker: Loudspeaker; Published: 24-Mar-1999; LatestRevisionDate: 17-Jul-2002; LatestRevisionNote: Re-released for DXP Platform.; PackageReference: PIN2; Publisher: Altium Limited
R22-R40 R_A0 = Res1: Resistor; Published: 8-Jun-2000; LatestRevisionDate: 17-Jul-2002; LatestRevisionNote: Re-released for DXP Platform.; PackageReference: AXIAL-0.3; Publisher: Altium Limited; PackageDescription: Axial Device, Thru-Hole; 2 Leads; 0.3 in Pin Spacing
  R22: Value: 1k
  R23 R24 R34: Value: 10K
  R25: Value: 1Meg
  R26 R28: Value: 4.7
  R27 R29 R33 R36 R40: Value: 1K
  R30 R37: Value: 400k
  R31 R38: Value: 700k
  R32 R39: Value: 700K
  R35: Value: 35k
  R_A0: Value: 0
Y3 = XTAL: Crystal Oscillator; Published: 8-Jun-2000; LatestRevisionDate: 17-Jul-2002; LatestRevisionNote: Re-released for DXP Platform.; PackageReference: R38; Publisher: Altium Limited; PackageDescription: Crystal, Thru-Hole; 2 Leads; Body 3.1 x 8.2 mm (Dia.xH)

## Nets that join several sheets
3V3P: CPU_Power_XTAL_Prog (40 pins), sdcard_ram (15 pins), Buttons (16 pins), LCD_touch_conn (10 pins), Audio (14 pins)
5V0P: CPU_Power_XTAL_Prog (CP2.2 P1.5), Audio (11 pins)
19V2P: CPU_Power_XTAL_Prog (P1.7), LCD_touch_conn (C60.2 C61.2 CON2.3 CON2.4)
GND: CPU_Power_XTAL_Prog (53 pins), sdcard_ram (9 pins), Buttons (23 pins), LCD_touch_conn (16 pins), Audio (16 pins)
19V2P_RET: CPU_Power_XTAL_Prog (P1.8), LCD_touch_conn (C60.1 C61.1 CON2.1 CON2.2)
Audio_DAC1: CPU_Power_XTAL_Prog (U1.50), Audio (C49.1)
Audio_DAC2: CPU_Power_XTAL_Prog (U1.51), Audio (C55.1)
FMC_A0: CPU_Power_XTAL_Prog (U1.16), sdcard_ram (U2.5)
FMC_A1: CPU_Power_XTAL_Prog (U1.17), sdcard_ram (U2.4)
FMC_A2: CPU_Power_XTAL_Prog (U1.18), sdcard_ram (U2.3)
FMC_A3: CPU_Power_XTAL_Prog (U1.19), sdcard_ram (U2.2)
FMC_A4: CPU_Power_XTAL_Prog (U1.20), sdcard_ram (U2.1)
FMC_A5: CPU_Power_XTAL_Prog (U1.21), sdcard_ram (U2.48)
FMC_A6: CPU_Power_XTAL_Prog (U1.60), sdcard_ram (U2.47)
FMC_A7: CPU_Power_XTAL_Prog (U1.63), sdcard_ram (U2.46)
FMC_A8: CPU_Power_XTAL_Prog (U1.64), sdcard_ram (U2.45)
FMC_A9: CPU_Power_XTAL_Prog (U1.65), sdcard_ram (U2.30)
FMC_A10: CPU_Power_XTAL_Prog (U1.66), sdcard_ram (U2.29)
FMC_A11: CPU_Power_XTAL_Prog (U1.67), sdcard_ram (U2.28)
FMC_A12: CPU_Power_XTAL_Prog (U1.106), sdcard_ram (U2.27)
FMC_A13: CPU_Power_XTAL_Prog (U1.107), sdcard_ram (U2.26)
FMC_A14: CPU_Power_XTAL_Prog (U1.108), sdcard_ram (U2.25)
FMC_A15: CPU_Power_XTAL_Prog (U1.109), sdcard_ram (U2.24)
FMC_A16: CPU_Power_XTAL_Prog (U1.99), sdcard_ram (U2.23)
FMC_A17: CPU_Power_XTAL_Prog (U1.100), sdcard_ram (U2.22)
FMC_A18: CPU_Power_XTAL_Prog (U1.101), sdcard_ram (U2.21)
FMC_A19: CPU_Power_XTAL_Prog (U1.2), sdcard_ram (U2.20)
FMC_D0: CPU_Power_XTAL_Prog (U1.104), sdcard_ram (U2.8)
FMC_D1: CPU_Power_XTAL_Prog (U1.105), sdcard_ram (U2.9)
FMC_D2: CPU_Power_XTAL_Prog (U1.142), sdcard_ram (U2.10)
FMC_D3: CPU_Power_XTAL_Prog (U1.143), sdcard_ram (U2.11)
FMC_D4: CPU_Power_XTAL_Prog (U1.68), sdcard_ram (U2.14)
FMC_D5: CPU_Power_XTAL_Prog (U1.69), sdcard_ram (U2.15)
FMC_D6: CPU_Power_XTAL_Prog (U1.70), sdcard_ram (U2.16)
FMC_D7: CPU_Power_XTAL_Prog (U1.73), sdcard_ram (U2.17)
FMC_D8: CPU_Power_XTAL_Prog (U1.74), sdcard_ram (U2.32)
FMC_D9: CPU_Power_XTAL_Prog (U1.75), sdcard_ram (U2.33)
FMC_D10: CPU_Power_XTAL_Prog (U1.76), sdcard_ram (U2.34)
FMC_D11: CPU_Power_XTAL_Prog (U1.77), sdcard_ram (U2.35)
FMC_D12: CPU_Power_XTAL_Prog (U1.78), sdcard_ram (U2.38)
FMC_D13: CPU_Power_XTAL_Prog (U1.96), sdcard_ram (U2.39)
FMC_D14: CPU_Power_XTAL_Prog (U1.97), sdcard_ram (U2.40)
FMC_D15: CPU_Power_XTAL_Prog (U1.98), sdcard_ram (U2.41)
FMC_NBL0: CPU_Power_XTAL_Prog (U1.169), sdcard_ram (U2.42)
FMC_NBL1: CPU_Power_XTAL_Prog (U1.170), sdcard_ram (U2.43)
I2C1_SCL: CPU_Power_XTAL_Prog (U1.164), LCD_touch_conn (CON3.3 R20.2), Audio (R23.1 U5.4)
I2C1_SDA: CPU_Power_XTAL_Prog (U1.165), LCD_touch_conn (CON3.4 R21.2), Audio (R24.1 U5.3)
INPUT_LATCH: CPU_Power_XTAL_Prog (U1.112), Buttons (U3.1 U4.1)
LCD_SPI_NEN: CPU_Power_XTAL_Prog (U1.26), LCD_touch_conn (CON2.9)
LTDC_B3: CPU_Power_XTAL_Prog (U1.154), LCD_touch_conn (CON2.15)
LTDC_B4: CPU_Power_XTAL_Prog (U1.155), LCD_touch_conn (CON2.16)
LTDC_B5: CPU_Power_XTAL_Prog (U1.47), LCD_touch_conn (CON2.17)
LTDC_B6: CPU_Power_XTAL_Prog (U1.175), LCD_touch_conn (CON2.18)
LTDC_B7: CPU_Power_XTAL_Prog (U1.176), LCD_touch_conn (CON2.19)
LTDC_CLK: CPU_Power_XTAL_Prog (U1.111), LCD_touch_conn (CON2.38)
LTDC_DE: CPU_Power_XTAL_Prog (U1.28), LCD_touch_conn (CON2.52)
LTDC_G2: CPU_Power_XTAL_Prog (U1.52), LCD_touch_conn (CON2.22)
LTDC_G3: CPU_Power_XTAL_Prog (U1.129), LCD_touch_conn (CON2.23)
LTDC_G4: CPU_Power_XTAL_Prog (U1.79), LCD_touch_conn (CON2.24)
LTDC_G5: CPU_Power_XTAL_Prog (U1.80), LCD_touch_conn (CON2.25)
LTDC_G6: CPU_Power_XTAL_Prog (U1.132), LCD_touch_conn (CON2.26)
LTDC_G7: CPU_Power_XTAL_Prog (U1.133), LCD_touch_conn (CON2.27)
LTDC_HSYNC: CPU_Power_XTAL_Prog (U1.12), LCD_touch_conn (CON2.36)
LTDC_R3: CPU_Power_XTAL_Prog (U1.56), LCD_touch_conn (CON2.31)
LTDC_R4: CPU_Power_XTAL_Prog (U1.122), LCD_touch_conn (CON2.32)
LTDC_R5: CPU_Power_XTAL_Prog (U1.88), LCD_touch_conn (CON2.33)
LTDC_R6: CPU_Power_XTAL_Prog (U1.57), LCD_touch_conn (CON2.34)
LTDC_R7: CPU_Power_XTAL_Prog (U1.110), LCD_touch_conn (CON2.35)
LTDC_VSYNC: CPU_Power_XTAL_Prog (U1.11), LCD_touch_conn (CON2.37)
MP3_DR: CPU_Power_XTAL_Prog (U1.131), Audio (U5.28)
RAM_NCS: CPU_Power_XTAL_Prog (U1.151), sdcard_ram (U2.7)
RAM_NOE: CPU_Power_XTAL_Prog (U1.146), sdcard_ram (U2.44)
RAM_NWE: CPU_Power_XTAL_Prog (U1.147), sdcard_ram (U2.18)
Reset: CPU_Power_XTAL_Prog (C26.2 P2.5 S1.0 U1.31), LCD_touch_conn (CON2.8)
SD_DETECT: CPU_Power_XTAL_Prog (U1.3), sdcard_ram (CON1.10 R6.2)
SDIO_CK: CPU_Power_XTAL_Prog (U1.141), sdcard_ram (CON1.5)
SDIO_CMD: CPU_Power_XTAL_Prog (U1.144), sdcard_ram (CON1.2 R1.1)
SDIO_D0: CPU_Power_XTAL_Prog (U1.117), sdcard_ram (CON1.7 R5.1)
SDIO_D1: CPU_Power_XTAL_Prog (U1.118), sdcard_ram (CON1.8 R4.1)
SDIO_D2: CPU_Power_XTAL_Prog (U1.139), sdcard_ram (CON1.9 R3.1)
SDIO_D3: CPU_Power_XTAL_Prog (U1.140), sdcard_ram (CON1.1 R2.1)
SPI2_INPUT_MISO: CPU_Power_XTAL_Prog (U1.34), Buttons (U3.9)
SPI2_INPUT_SCK: CPU_Power_XTAL_Prog (U1.93), Buttons (U3.2 U4.2)
SPI3_MUSIC_MOSI: CPU_Power_XTAL_Prog (U1.150), Audio (U5.5)
SPI3_MUSIC_SCK: CPU_Power_XTAL_Prog (U1.161), Audio (U5.6)
SPI5_LCD_MOSI: CPU_Power_XTAL_Prog (U1.27), LCD_touch_conn (CON2.11)
SPI5_LCD_SCK: CPU_Power_XTAL_Prog (U1.25), LCD_touch_conn (CON2.10)
TOUCH_NINT: CPU_Power_XTAL_Prog (U1.45), LCD_touch_conn (CON3.5)